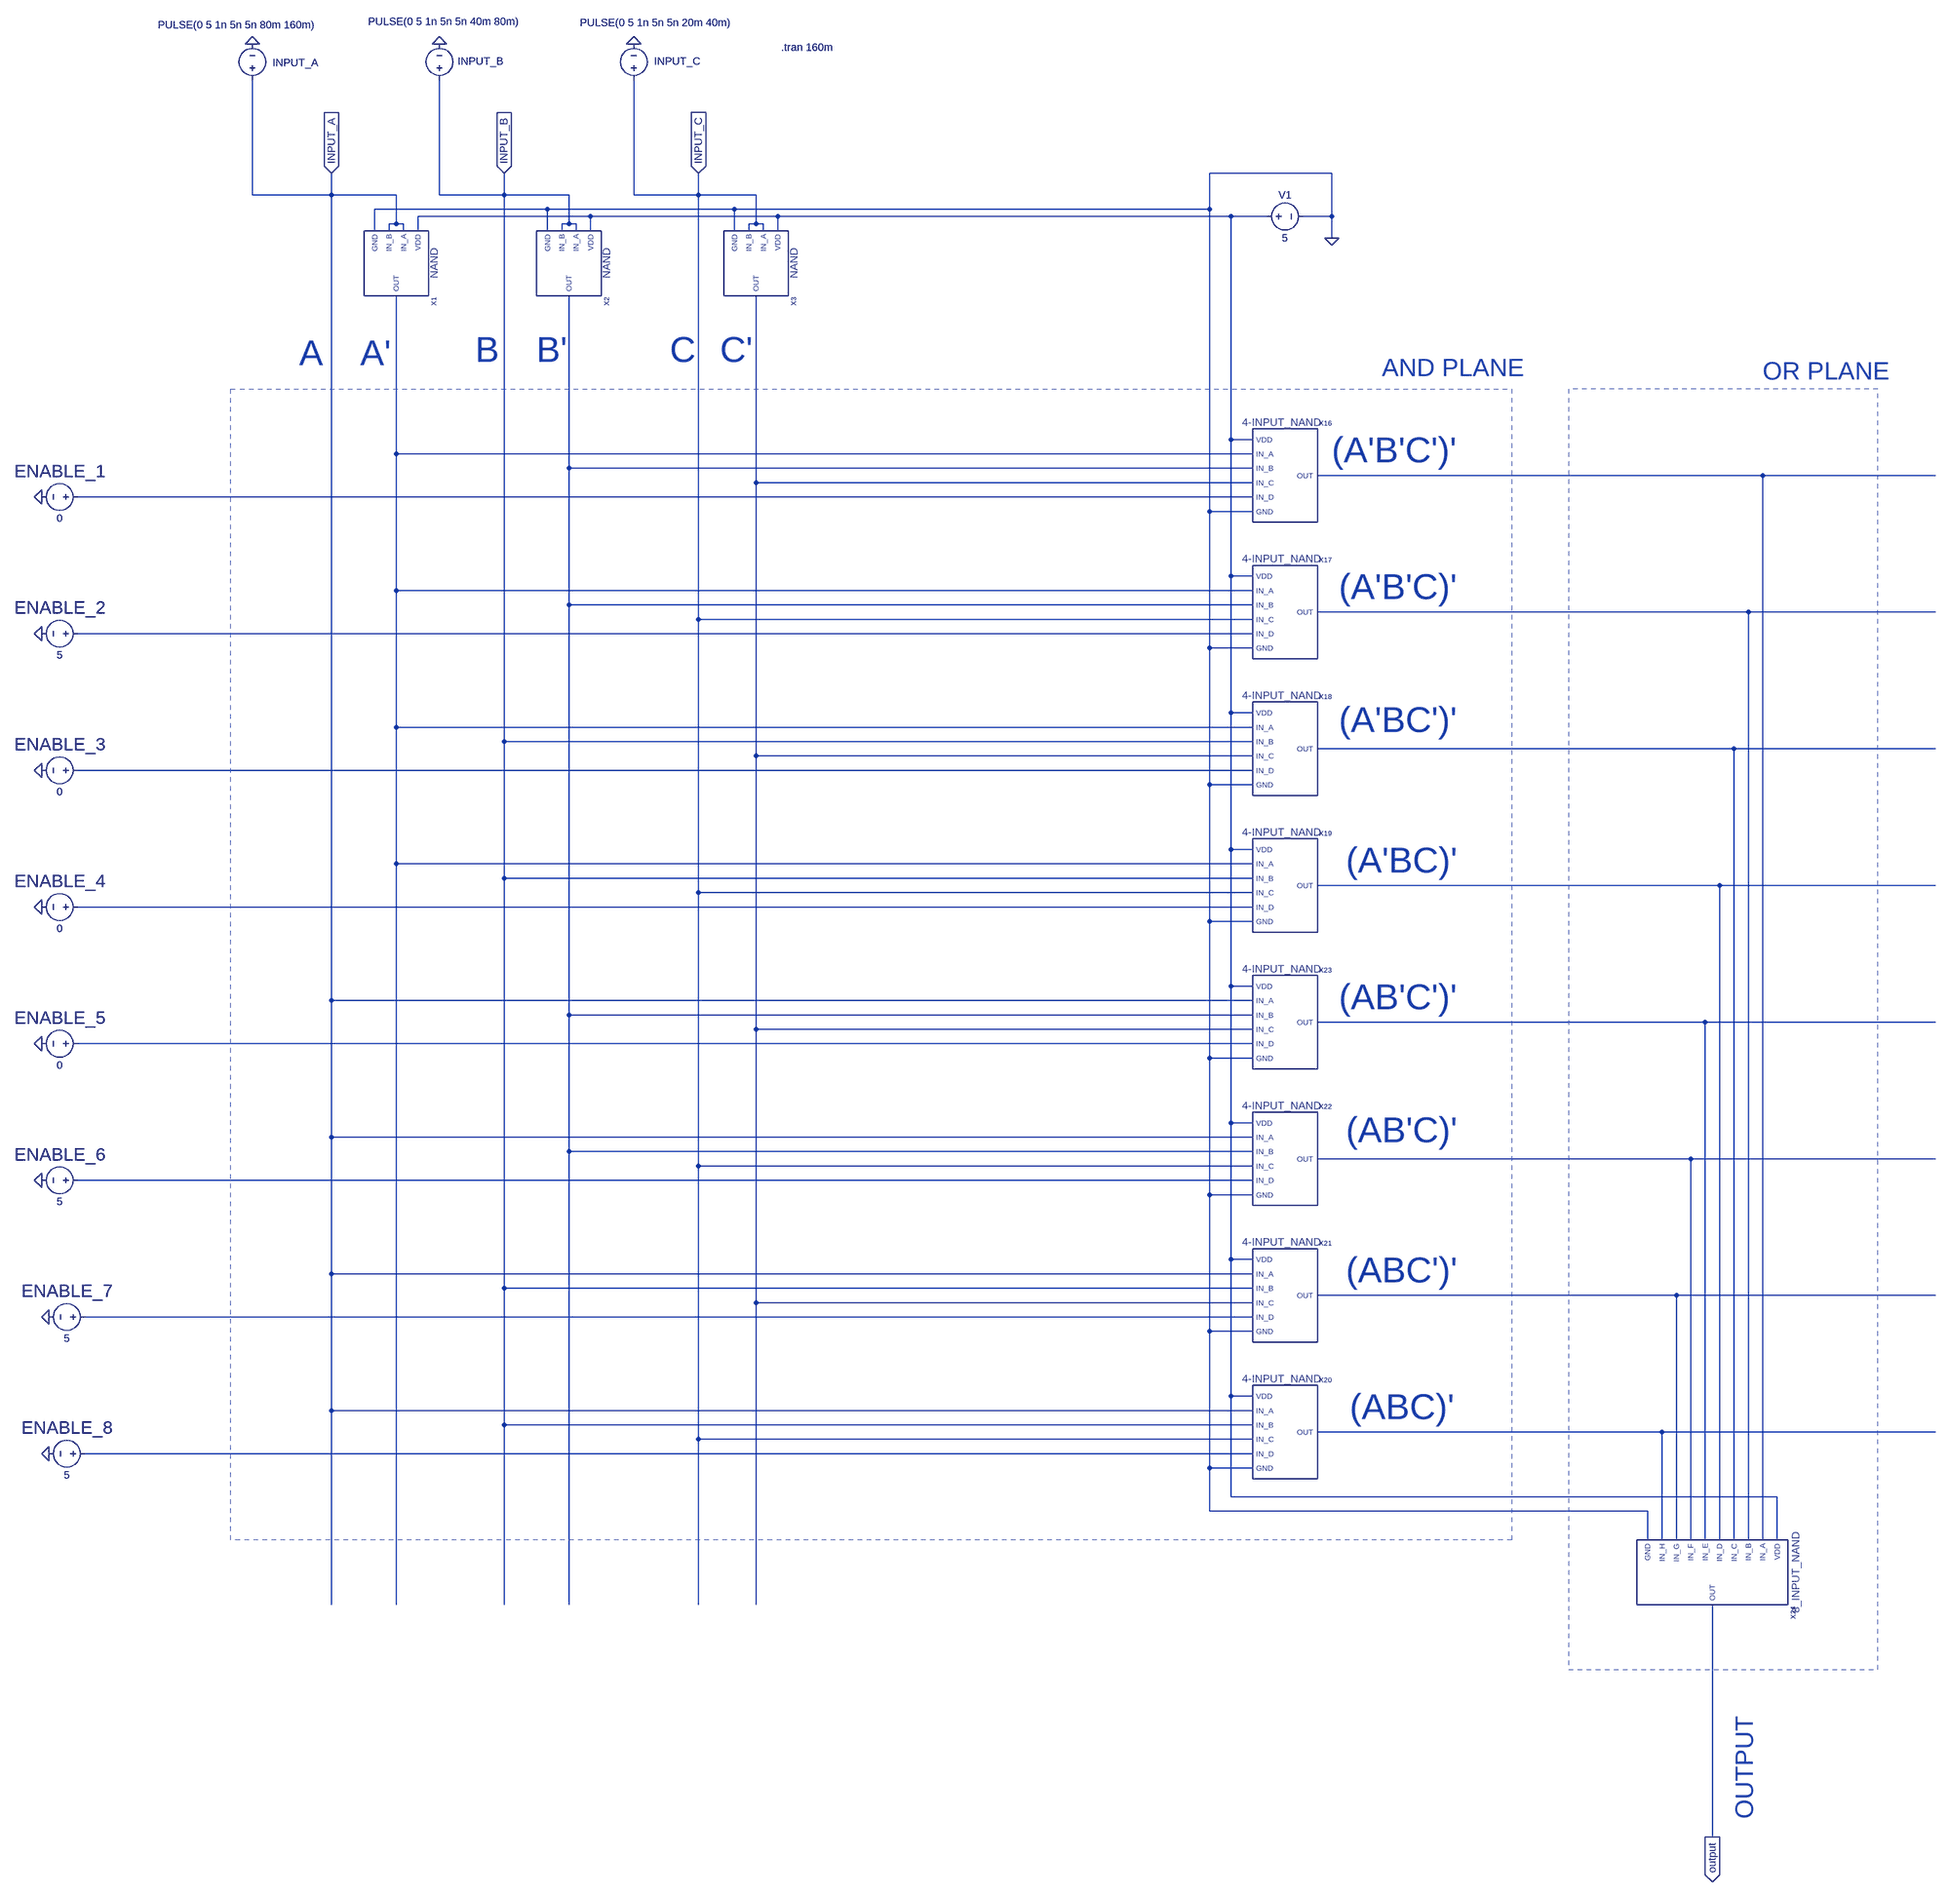
[diagram p0: schematic Circuit2_Part3_3inputCombinational_PLD.asc]
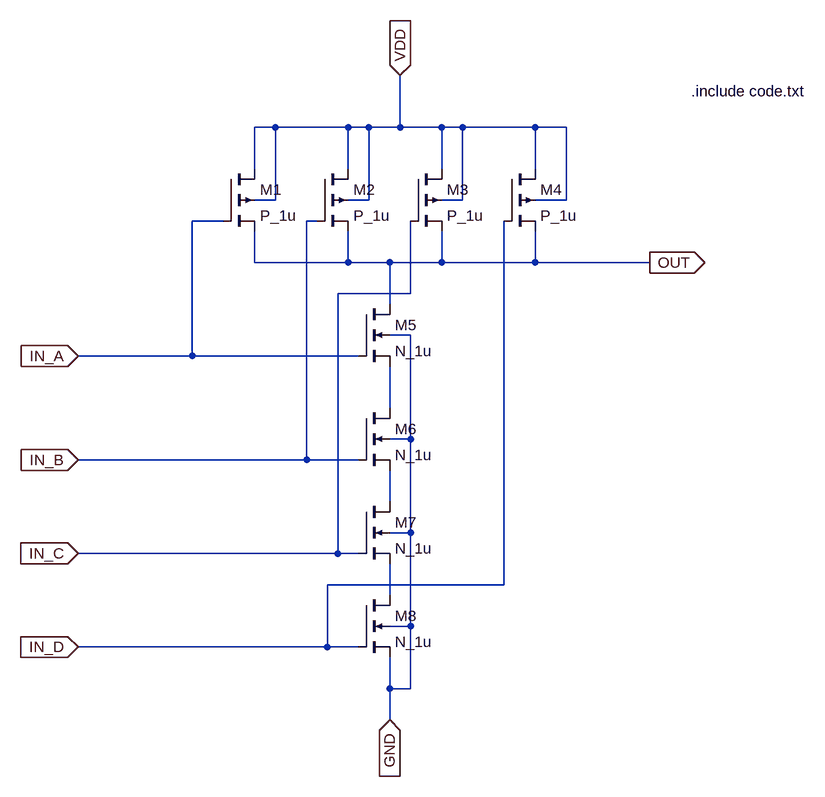
[diagram p1: sub-circuit circuit2_part3_4inputnandusingmosfets.asc]
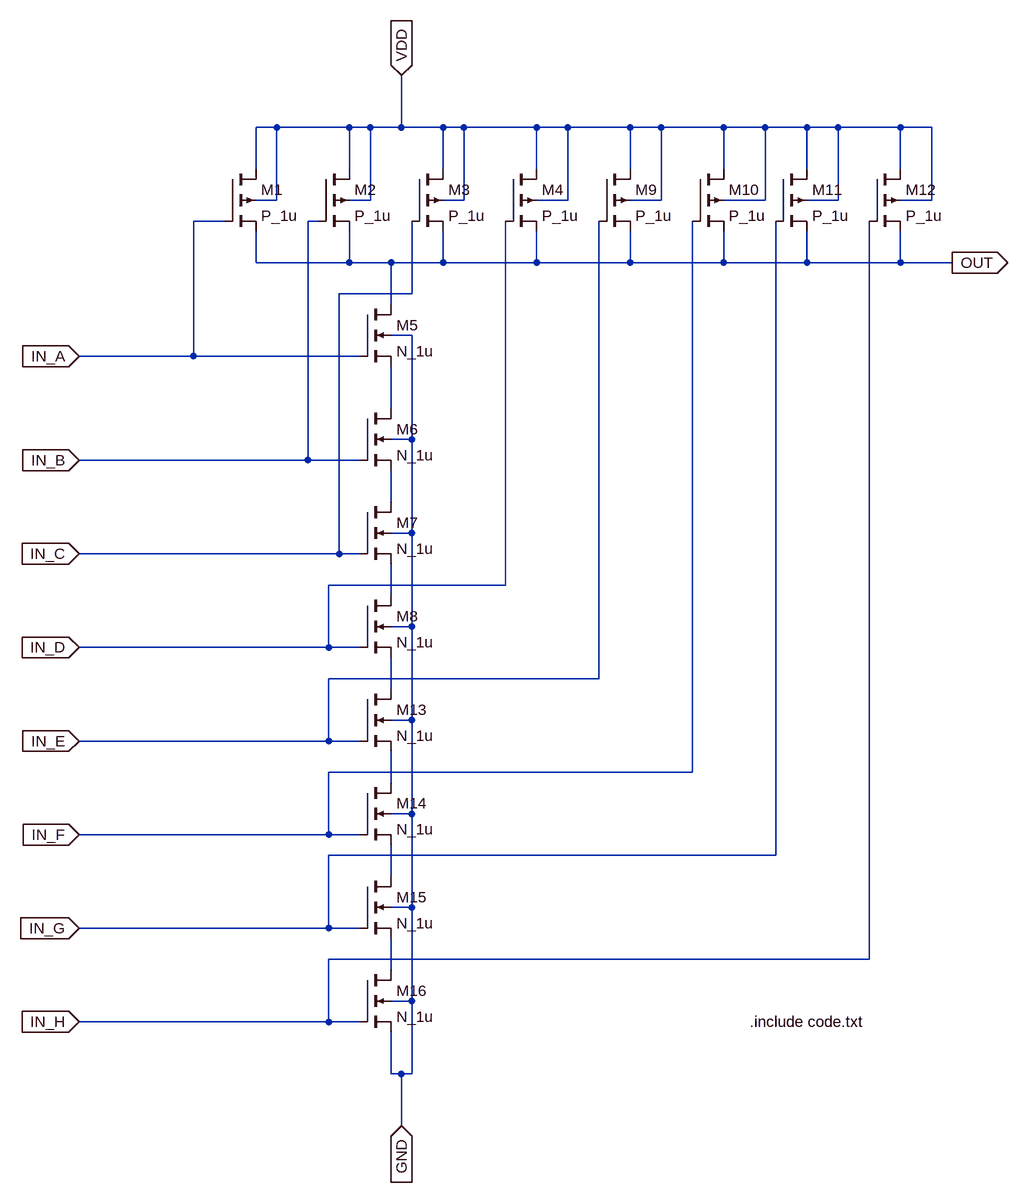
[diagram p2: sub-circuit circuit2_part3_8inputnandusingmosfets.asc]
Circuit2_Part3_3inputCombinational_PLD.asc, the LTspice schematic file:
Version 4
SHEET 1 4452 2924
WIRE 208 -1728 -64 -1728
WIRE -2192 -1680 -2192 -1936
WIRE -2016 -1680 -2016 -1728
WIRE -2016 -1680 -2192 -1680
WIRE -1872 -1680 -2016 -1680
WIRE -1776 -1680 -1776 -1936
WIRE -1632 -1680 -1632 -1728
WIRE -1632 -1680 -1776 -1680
WIRE -1488 -1680 -1632 -1680
WIRE -1344 -1680 -1344 -1936
WIRE -1200 -1680 -1200 -1728
WIRE -1200 -1680 -1344 -1680
WIRE -1072 -1680 -1200 -1680
WIRE -1536 -1648 -1920 -1648
WIRE -1120 -1648 -1536 -1648
WIRE -64 -1648 -64 -1728
WIRE -64 -1648 -1120 -1648
WIRE -1440 -1632 -1824 -1632
WIRE -1024 -1632 -1440 -1632
WIRE -16 -1632 -1024 -1632
WIRE 64 -1632 -16 -1632
WIRE 208 -1632 208 -1728
WIRE 208 -1632 144 -1632
WIRE -1872 -1616 -1872 -1680
WIRE -1872 -1616 -1888 -1616
WIRE -1856 -1616 -1872 -1616
WIRE -1488 -1616 -1488 -1680
WIRE -1488 -1616 -1504 -1616
WIRE -1472 -1616 -1488 -1616
WIRE -1072 -1616 -1072 -1680
WIRE -1072 -1616 -1088 -1616
WIRE -1056 -1616 -1072 -1616
WIRE -1920 -1600 -1920 -1648
WIRE -1888 -1600 -1888 -1616
WIRE -1856 -1600 -1856 -1616
WIRE -1824 -1600 -1824 -1632
WIRE -1536 -1600 -1536 -1648
WIRE -1504 -1600 -1504 -1616
WIRE -1472 -1600 -1472 -1616
WIRE -1440 -1600 -1440 -1632
WIRE -1120 -1600 -1120 -1648
WIRE -1088 -1600 -1088 -1616
WIRE -1056 -1600 -1056 -1616
WIRE -1024 -1600 -1024 -1632
WIRE 208 -1584 208 -1632
WIRE -16 -1136 -16 -1632
WIRE 32 -1136 -16 -1136
WIRE -1872 -1104 -1872 -1456
WIRE 32 -1104 -1872 -1104
WIRE -1488 -1072 -1488 -1456
WIRE 32 -1072 -1488 -1072
WIRE 1968 -1056 176 -1056
WIRE 2384 -1056 1968 -1056
WIRE -1072 -1040 -1072 -1456
WIRE 32 -1040 -1072 -1040
WIRE 32 -1008 -2944 -1008
WIRE -64 -976 -64 -1648
WIRE 32 -976 -64 -976
WIRE -16 -832 -16 -1136
WIRE 32 -832 -16 -832
WIRE -1872 -800 -1872 -1104
WIRE 32 -800 -1872 -800
WIRE -1488 -768 -1488 -1072
WIRE 32 -768 -1488 -768
WIRE 1936 -752 176 -752
WIRE 2384 -752 1936 -752
WIRE -1200 -736 -1200 -1680
WIRE 32 -736 -1200 -736
WIRE 32 -704 -2944 -704
WIRE -64 -672 -64 -976
WIRE 32 -672 -64 -672
WIRE -16 -528 -16 -832
WIRE 32 -528 -16 -528
WIRE -1872 -496 -1872 -800
WIRE 32 -496 -1872 -496
WIRE -1632 -464 -1632 -1680
WIRE 32 -464 -1632 -464
WIRE 1904 -448 176 -448
WIRE 2384 -448 1904 -448
WIRE -1072 -432 -1072 -1040
WIRE 32 -432 -1072 -432
WIRE 32 -400 -2944 -400
WIRE -64 -368 -64 -672
WIRE 32 -368 -64 -368
WIRE -16 -224 -16 -528
WIRE 32 -224 -16 -224
WIRE -1872 -192 -1872 -496
WIRE 32 -192 -1872 -192
WIRE -1632 -160 -1632 -464
WIRE 32 -160 -1632 -160
WIRE 1872 -144 176 -144
WIRE 2384 -144 1872 -144
WIRE -1200 -128 -1200 -736
WIRE 32 -128 -1200 -128
WIRE 32 -96 -2944 -96
WIRE -64 -64 -64 -368
WIRE 32 -64 -64 -64
WIRE -16 80 -16 -224
WIRE 32 80 -16 80
WIRE -2016 112 -2016 -1680
WIRE 32 112 -2016 112
WIRE -1488 144 -1488 -768
WIRE 32 144 -1488 144
WIRE 1840 160 176 160
WIRE 2384 160 1840 160
WIRE -1072 176 -1072 -432
WIRE 32 176 -1072 176
WIRE 32 208 -2944 208
WIRE -64 240 -64 -64
WIRE 32 240 -64 240
WIRE -16 384 -16 80
WIRE 32 384 -16 384
WIRE -2016 416 -2016 112
WIRE 32 416 -2016 416
WIRE -1488 448 -1488 144
WIRE 32 448 -1488 448
WIRE 1808 464 176 464
WIRE 2384 464 1808 464
WIRE -1200 480 -1200 -128
WIRE 32 480 -1200 480
WIRE 32 512 -2944 512
WIRE -64 544 -64 240
WIRE 32 544 -64 544
WIRE -16 688 -16 384
WIRE 32 688 -16 688
WIRE -2016 720 -2016 416
WIRE 32 720 -2016 720
WIRE -1632 752 -1632 -160
WIRE 32 752 -1632 752
WIRE 1776 768 176 768
WIRE 2384 768 1776 768
WIRE -1072 784 -1072 176
WIRE 32 784 -1072 784
WIRE 32 816 -2928 816
WIRE -64 848 -64 544
WIRE 32 848 -64 848
WIRE -16 992 -16 688
WIRE 32 992 -16 992
WIRE -2016 1024 -2016 720
WIRE 32 1024 -2016 1024
WIRE -1632 1056 -1632 752
WIRE 32 1056 -1632 1056
WIRE 1744 1072 176 1072
WIRE 2384 1072 1744 1072
WIRE -1200 1088 -1200 480
WIRE 32 1088 -1200 1088
WIRE 32 1120 -2928 1120
WIRE -64 1152 -64 848
WIRE 32 1152 -64 1152
WIRE -16 1216 -16 992
WIRE 2000 1216 -16 1216
WIRE -64 1248 -64 1152
WIRE 1712 1248 -64 1248
WIRE 1712 1312 1712 1248
WIRE 1744 1312 1744 1072
WIRE 1776 1312 1776 768
WIRE 1808 1312 1808 464
WIRE 1840 1312 1840 160
WIRE 1872 1312 1872 -144
WIRE 1904 1312 1904 -448
WIRE 1936 1312 1936 -752
WIRE 1968 1312 1968 -1056
WIRE 2000 1312 2000 1216
WIRE -2016 1456 -2016 1024
WIRE -1872 1456 -1872 -192
WIRE -1632 1456 -1632 1056
WIRE -1488 1456 -1488 448
WIRE -1200 1456 -1200 1088
WIRE -1072 1456 -1072 784
WIRE 1856 2016 1856 1456
FLAG -2192 -2016 0
FLAG -1776 -2016 0
FLAG -1344 -2016 0
FLAG -2016 -1728 INPUT_A
IOPIN -2016 -1728 In
FLAG -1632 -1728 INPUT_B
IOPIN -1632 -1728 In
FLAG -1200 -1728 INPUT_C
IOPIN -1200 -1728 In
FLAG 1856 2016 output
IOPIN 1856 2016 Out
FLAG -3024 -1008 0
FLAG -3024 -704 0
FLAG -3024 -400 0
FLAG -3024 -96 0
FLAG -3024 208 0
FLAG -3008 1120 0
FLAG -3008 816 0
FLAG -3024 512 0
FLAG 208 -1584 0
SYMBOL voltage -1776 -1920 R180
WINDOW 123 0 0 Left 0
WINDOW 39 0 0 Left 0
WINDOW 0 -142 57 Left 2
WINDOW 3 -179 146 Left 2
SYMATTR InstName INPUT_B
SYMATTR Value PULSE(0 5 1n 5n 5n 40m 80m)
SYMBOL voltage -1344 -1920 R180
WINDOW 123 0 0 Left 0
WINDOW 39 0 0 Left 0
WINDOW 0 -148 57 Left 2
WINDOW 3 -218 143 Left 2
SYMATTR InstName INPUT_C
SYMATTR Value PULSE(0 5 1n 5n 5n 20m 40m)
SYMBOL voltage -2192 -1920 R180
WINDOW 123 0 0 Left 0
WINDOW 39 0 0 Left 0
WINDOW 0 -146 54 Left 2
WINDOW 3 -141 138 Left 2
SYMATTR InstName INPUT_A
SYMATTR Value PULSE(0 5 1n 5n 5n 80m 160m)
SYMBOL voltage -2928 -1008 R90
WINDOW 0 -32 56 VBottom 4
WINDOW 3 32 56 VTop 2
WINDOW 123 0 0 Left 0
WINDOW 39 0 0 Left 0
SYMATTR InstName ENABLE_1
SYMATTR Value 0
SYMBOL voltage -2928 -704 R90
WINDOW 0 -32 56 VBottom 4
WINDOW 3 32 56 VTop 2
WINDOW 123 0 0 Left 0
WINDOW 39 0 0 Left 0
SYMATTR InstName ENABLE_2
SYMATTR Value 5
SYMBOL voltage -2928 -400 R90
WINDOW 0 -32 56 VBottom 4
WINDOW 3 32 56 VTop 2
WINDOW 123 0 0 Left 0
WINDOW 39 0 0 Left 0
SYMATTR InstName ENABLE_3
SYMATTR Value 0
SYMBOL voltage -2928 -96 R90
WINDOW 0 -32 56 VBottom 4
WINDOW 3 32 56 VTop 2
WINDOW 123 0 0 Left 0
WINDOW 39 0 0 Left 0
SYMATTR InstName ENABLE_4
SYMATTR Value 0
SYMBOL voltage -2928 208 R90
WINDOW 0 -32 56 VBottom 4
WINDOW 3 32 56 VTop 2
WINDOW 123 0 0 Left 0
WINDOW 39 0 0 Left 0
SYMATTR InstName ENABLE_5
SYMATTR Value 0
SYMBOL voltage -2928 512 R90
WINDOW 0 -32 56 VBottom 4
WINDOW 3 32 56 VTop 2
WINDOW 123 0 0 Left 0
WINDOW 39 0 0 Left 0
SYMATTR InstName ENABLE_6
SYMATTR Value 5
SYMBOL voltage -2912 816 R90
WINDOW 0 -32 56 VBottom 4
WINDOW 3 32 56 VTop 2
WINDOW 123 0 0 Left 0
WINDOW 39 0 0 Left 0
SYMATTR InstName ENABLE_7
SYMATTR Value 5
SYMBOL voltage -2912 1120 R90
WINDOW 0 -32 56 VBottom 4
WINDOW 3 32 56 VTop 2
WINDOW 123 0 0 Left 0
WINDOW 39 0 0 Left 0
SYMATTR InstName ENABLE_8
SYMATTR Value 5
SYMBOL voltage 48 -1632 R270
WINDOW 0 32 56 VTop 2
WINDOW 3 -32 56 VBottom 2
WINDOW 123 0 0 Left 0
WINDOW 39 0 0 Left 0
SYMATTR InstName V1
SYMATTR Value 5
SYMBOL Circuit2_Part3_4inputNANDUsingMosfets 96 -1056 R0
SYMATTR InstName X16
SYMBOL Circuit2_Part3_4inputNANDUsingMosfets 96 -752 R0
SYMATTR InstName X17
SYMBOL Circuit2_Part3_4inputNANDUsingMosfets 96 -448 R0
SYMATTR InstName X18
SYMBOL Circuit2_Part3_4inputNANDUsingMosfets 96 -144 R0
SYMATTR InstName X19
SYMBOL Circuit2_Part3_4inputNANDUsingMosfets 96 1072 R0
SYMATTR InstName X20
SYMBOL Circuit2_Part3_4inputNANDUsingMosfets 96 768 R0
SYMATTR InstName X21
SYMBOL Circuit2_Part3_4inputNANDUsingMosfets 96 464 R0
SYMATTR InstName X22
SYMBOL Circuit2_Part3_4inputNANDUsingMosfets 96 160 R0
SYMATTR InstName X23
SYMBOL Circuit2_Part3_8inputNANDUsingMosfets 1856 1376 R90
SYMATTR InstName X24
SYMBOL Circuit2_Part3_NANDUsingMosfets -1872 -1536 R90
SYMATTR InstName X1
SYMBOL Circuit2_Part3_NANDUsingMosfets -1488 -1536 R90
SYMATTR InstName X2
SYMBOL Circuit2_Part3_NANDUsingMosfets -1072 -1536 R90
SYMATTR InstName X3
TEXT -1016 -2008 Left 2 !.tran 160m
TEXT -2088 -1328 Left 6 ;A
TEXT -1952 -1328 Left 6 ;A'
TEXT -1696 -1336 Left 6 ;B
TEXT -1560 -1336 Left 6 ;B'
TEXT -1264 -1336 Left 6 ;C
TEXT -1152 -1336 Left 6 ;C'
TEXT 208 -1112 Left 6 ;(A'B'C')'
TEXT 224 -808 Left 6 ;(A'B'C)'
TEXT 224 -512 Left 6 ;(A'BC')'
TEXT 240 -200 Left 6 ;(A'BC)'
TEXT 224 104 Left 6 ;(AB'C')'
TEXT 240 400 Left 6 ;(AB'C)'
TEXT 240 712 Left 6 ;(ABC')'
TEXT 248 1016 Left 6 ;(ABC)'
TEXT 320 -1296 Left 5 ;AND PLANE
TEXT 1968 -1288 Left 5 ;OR PLANE
TEXT 1928 1976 VLeft 5 ;OUTPUT
RECTANGLE Normal -2240 -1248 608 1312 2
RECTANGLE Normal 2224 -1248 1536 1600 2

circuit2_part3_4inputnandusingmosfets.asc, the sub-circuit schematic file:
Version 4
SHEET 1 932 1008
WIRE 96 -16 64 -16
WIRE 208 -16 96 -16
WIRE 240 -16 208 -16
WIRE 288 -16 288 -96
WIRE 288 -16 240 -16
WIRE 352 -16 288 -16
WIRE 384 -16 352 -16
WIRE 496 -16 384 -16
WIRE 544 -16 496 -16
WIRE 64 48 64 -16
WIRE 208 48 208 -16
WIRE 352 48 352 -16
WIRE 496 48 496 -16
WIRE 96 96 96 -16
WIRE 96 96 64 96
WIRE 240 96 240 -16
WIRE 240 96 208 96
WIRE 384 96 384 -16
WIRE 384 96 352 96
WIRE 544 96 544 -16
WIRE 544 96 496 96
WIRE 16 128 -32 128
WIRE 160 128 144 128
WIRE 64 192 64 144
WIRE 208 192 208 144
WIRE 208 192 64 192
WIRE 272 192 208 192
WIRE 352 192 352 144
WIRE 352 192 272 192
WIRE 496 192 496 144
WIRE 496 192 352 192
WIRE 672 192 496 192
WIRE 304 240 304 128
WIRE 304 240 192 240
WIRE 272 256 272 192
WIRE 304 304 272 304
WIRE -32 336 -32 128
WIRE -32 336 -208 336
WIRE 224 336 -32 336
WIRE 272 416 272 352
WIRE 304 464 304 304
WIRE 304 464 272 464
WIRE 144 496 144 128
WIRE 144 496 -208 496
WIRE 224 496 144 496
WIRE 272 560 272 512
WIRE 304 608 304 464
WIRE 304 608 272 608
WIRE 192 640 192 240
WIRE 192 640 -208 640
WIRE 224 640 192 640
WIRE 448 688 448 128
WIRE 448 688 176 688
WIRE 272 704 272 656
WIRE 304 752 304 608
WIRE 304 752 272 752
WIRE 176 784 176 688
WIRE 176 784 -208 784
WIRE 224 784 176 784
WIRE 272 848 272 800
WIRE 304 848 304 752
WIRE 304 848 272 848
WIRE 272 896 272 848
FLAG -208 336 IN_A
IOPIN -208 336 In
FLAG -208 496 IN_B
IOPIN -208 496 In
FLAG -208 640 IN_C
IOPIN -208 640 In
FLAG -208 784 IN_D
IOPIN -208 784 In
FLAG 288 -96 VDD
IOPIN 288 -96 In
FLAG 672 192 OUT
IOPIN 672 192 Out
FLAG 272 896 GND
IOPIN 272 896 In
SYMBOL pmos4 16 48 R0
SYMATTR InstName M1
SYMATTR Value P_1u
SYMATTR Value2 l=1u w=10u
SYMBOL pmos4 160 48 R0
SYMATTR InstName M2
SYMATTR Value P_1u
SYMATTR Value2 l=1u w=10u
SYMBOL pmos4 304 48 R0
SYMATTR InstName M3
SYMATTR Value P_1u
SYMATTR Value2 l=1u w=10u
SYMBOL pmos4 448 48 R0
SYMATTR InstName M4
SYMATTR Value P_1u
SYMATTR Value2 l=1u w=10u
SYMBOL nmos4 224 256 R0
SYMATTR InstName M5
SYMATTR Value N_1u
SYMATTR Value2 l=1u w=10u
SYMBOL nmos4 224 416 R0
SYMATTR InstName M6
SYMATTR Value N_1u
SYMATTR Value2 l=1u w=10u
SYMBOL nmos4 224 560 R0
SYMATTR InstName M7
SYMATTR Value N_1u
SYMATTR Value2 l=1u w=10u
SYMBOL nmos4 224 704 R0
SYMATTR InstName M8
SYMATTR Value N_1u
SYMATTR Value2 l=1u w=10u
TEXT 736 -72 Left 2 !.include code.txt

circuit2_part3_8inputnandusingmosfets.asc, the sub-circuit schematic file:
Version 4
SHEET 1 1244 1632
WIRE 96 -16 64 -16
WIRE 208 -16 96 -16
WIRE 240 -16 208 -16
WIRE 288 -16 288 -96
WIRE 288 -16 240 -16
WIRE 352 -16 288 -16
WIRE 384 -16 352 -16
WIRE 496 -16 384 -16
WIRE 544 -16 496 -16
WIRE 640 -16 544 -16
WIRE 688 -16 640 -16
WIRE 784 -16 688 -16
WIRE 848 -16 784 -16
WIRE 912 -16 848 -16
WIRE 960 -16 912 -16
WIRE 1056 -16 960 -16
WIRE 1104 -16 1056 -16
WIRE 64 48 64 -16
WIRE 208 48 208 -16
WIRE 352 48 352 -16
WIRE 496 48 496 -16
WIRE 640 48 640 -16
WIRE 784 48 784 -16
WIRE 912 48 912 -16
WIRE 1056 48 1056 -16
WIRE 96 96 96 -16
WIRE 96 96 64 96
WIRE 240 96 240 -16
WIRE 240 96 208 96
WIRE 384 96 384 -16
WIRE 384 96 352 96
WIRE 544 96 544 -16
WIRE 544 96 496 96
WIRE 688 96 688 -16
WIRE 688 96 640 96
WIRE 848 96 848 -16
WIRE 848 96 784 96
WIRE 960 96 960 -16
WIRE 960 96 912 96
WIRE 1104 96 1104 -16
WIRE 1104 96 1056 96
WIRE 16 128 -32 128
WIRE 160 128 144 128
WIRE 64 192 64 144
WIRE 208 192 208 144
WIRE 208 192 64 192
WIRE 272 192 208 192
WIRE 352 192 352 144
WIRE 352 192 272 192
WIRE 496 192 496 144
WIRE 496 192 352 192
WIRE 640 192 640 144
WIRE 640 192 496 192
WIRE 784 192 784 144
WIRE 784 192 640 192
WIRE 912 192 912 144
WIRE 912 192 784 192
WIRE 1056 192 1056 144
WIRE 1056 192 912 192
WIRE 1136 192 1056 192
WIRE 304 240 304 128
WIRE 304 240 192 240
WIRE 272 256 272 192
WIRE 304 304 272 304
WIRE -32 336 -32 128
WIRE -32 336 -208 336
WIRE 224 336 -32 336
WIRE 272 416 272 352
WIRE 304 464 304 304
WIRE 304 464 272 464
WIRE 144 496 144 128
WIRE 144 496 -208 496
WIRE 224 496 144 496
WIRE 272 560 272 512
WIRE 304 608 304 464
WIRE 304 608 272 608
WIRE 192 640 192 240
WIRE 192 640 -208 640
WIRE 224 640 192 640
WIRE 448 688 448 128
WIRE 448 688 176 688
WIRE 272 704 272 656
WIRE 304 752 304 608
WIRE 304 752 272 752
WIRE 176 784 176 688
WIRE 176 784 -208 784
WIRE 224 784 176 784
WIRE 592 832 592 128
WIRE 592 832 176 832
WIRE 272 848 272 800
WIRE 304 896 304 752
WIRE 304 896 272 896
WIRE 176 928 176 832
WIRE 176 928 -208 928
WIRE 224 928 176 928
WIRE 736 976 736 128
WIRE 736 976 176 976
WIRE 272 992 272 944
WIRE 304 1040 304 896
WIRE 304 1040 272 1040
WIRE 176 1072 176 976
WIRE 176 1072 -208 1072
WIRE 224 1072 176 1072
WIRE 864 1104 864 128
WIRE 864 1104 176 1104
WIRE 272 1136 272 1088
WIRE 304 1184 304 1040
WIRE 304 1184 272 1184
WIRE 176 1216 176 1104
WIRE 176 1216 -208 1216
WIRE 224 1216 176 1216
WIRE 1008 1264 1008 128
WIRE 1008 1264 176 1264
WIRE 272 1280 272 1232
WIRE 304 1328 304 1184
WIRE 304 1328 272 1328
WIRE 176 1360 176 1264
WIRE 176 1360 -208 1360
WIRE 224 1360 176 1360
WIRE 272 1440 272 1376
WIRE 288 1440 272 1440
WIRE 304 1440 304 1328
WIRE 304 1440 288 1440
WIRE 288 1520 288 1440
FLAG -208 336 IN_A
IOPIN -208 336 In
FLAG -208 496 IN_B
IOPIN -208 496 In
FLAG -208 640 IN_C
IOPIN -208 640 In
FLAG -208 784 IN_D
IOPIN -208 784 In
FLAG 288 -96 VDD
IOPIN 288 -96 In
FLAG 1136 192 OUT
IOPIN 1136 192 Out
FLAG 288 1520 GND
IOPIN 288 1520 In
FLAG -208 928 IN_E
IOPIN -208 928 In
FLAG -208 1072 IN_F
IOPIN -208 1072 In
FLAG -208 1216 IN_G
IOPIN -208 1216 In
FLAG -208 1360 IN_H
IOPIN -208 1360 In
SYMBOL pmos4 16 48 R0
SYMATTR InstName M1
SYMATTR Value P_1u
SYMATTR Value2 l=1u w=10u
SYMBOL pmos4 160 48 R0
SYMATTR InstName M2
SYMATTR Value P_1u
SYMATTR Value2 l=1u w=10u
SYMBOL pmos4 304 48 R0
SYMATTR InstName M3
SYMATTR Value P_1u
SYMATTR Value2 l=1u w=10u
SYMBOL pmos4 448 48 R0
SYMATTR InstName M4
SYMATTR Value P_1u
SYMATTR Value2 l=1u w=10u
SYMBOL nmos4 224 256 R0
SYMATTR InstName M5
SYMATTR Value N_1u
SYMATTR Value2 l=1u w=10u
SYMBOL nmos4 224 416 R0
SYMATTR InstName M6
SYMATTR Value N_1u
SYMATTR Value2 l=1u w=10u
SYMBOL nmos4 224 560 R0
SYMATTR InstName M7
SYMATTR Value N_1u
SYMATTR Value2 l=1u w=10u
SYMBOL nmos4 224 704 R0
SYMATTR InstName M8
SYMATTR Value N_1u
SYMATTR Value2 l=1u w=10u
SYMBOL pmos4 592 48 R0
SYMATTR InstName M9
SYMATTR Value P_1u
SYMATTR Value2 l=1u w=10u
SYMBOL pmos4 736 48 R0
SYMATTR InstName M10
SYMATTR Value P_1u
SYMATTR Value2 l=1u w=10u
SYMBOL pmos4 864 48 R0
SYMATTR InstName M11
SYMATTR Value P_1u
SYMATTR Value2 l=1u w=10u
SYMBOL pmos4 1008 48 R0
SYMATTR InstName M12
SYMATTR Value P_1u
SYMATTR Value2 l=1u w=10u
SYMBOL nmos4 224 848 R0
SYMATTR InstName M13
SYMATTR Value N_1u
SYMATTR Value2 l=1u w=10u
SYMBOL nmos4 224 992 R0
SYMATTR InstName M14
SYMATTR Value N_1u
SYMATTR Value2 l=1u w=10u
SYMBOL nmos4 224 1136 R0
SYMATTR InstName M15
SYMATTR Value N_1u
SYMATTR Value2 l=1u w=10u
SYMBOL nmos4 224 1280 R0
SYMATTR InstName M16
SYMATTR Value N_1u
SYMATTR Value2 l=1u w=10u
TEXT 824 1360 Left 2 !.include code.txt

The netlist it stands for:
* Circuit2_Part3_3inputCombinational_PLD.asc
V§INPUT_B INPUT_B 0 PULSE(0 5 1n 5n 5n 40m 80m)
V§INPUT_C INPUT_C 0 PULSE(0 5 1n 5n 5n 20m 40m)
V§INPUT_A INPUT_A 0 PULSE(0 5 1n 5n 5n 80m 160m)
V§ENABLE_1 N006 0 0
V§ENABLE_2 N008 0 5
V§ENABLE_3 N010 0 0
V§ENABLE_4 N012 0 0
V§ENABLE_5 N014 0 0
V§ENABLE_6 N016 0 5
V§ENABLE_7 N018 0 5
V§ENABLE_8 N020 0 5
V1 N001 0 5
XX16 0 N002 N003 N005 N006 N001 N004 circuit2_part3_4inputnandusingmosfets
XX17 0 N002 N003 INPUT_C N008 N001 N007 circuit2_part3_4inputnandusingmosfets
XX18 0 N002 INPUT_B N005 N010 N001 N009 circuit2_part3_4inputnandusingmosfets
XX19 0 N002 INPUT_B INPUT_C N012 N001 N011 circuit2_part3_4inputnandusingmosfets
XX20 0 INPUT_A INPUT_B INPUT_C N020 N001 N019 circuit2_part3_4inputnandusingmosfets
XX21 0 INPUT_A INPUT_B N005 N018 N001 N017 circuit2_part3_4inputnandusingmosfets
XX22 0 INPUT_A N003 INPUT_C N016 N001 N015 circuit2_part3_4inputnandusingmosfets
XX23 0 INPUT_A N003 N005 N014 N001 N013 circuit2_part3_4inputnandusingmosfets
XX24 0 N004 N007 N009 N011 N013 N015 N017 N019 N001 output circuit2_part3_8inputnandusingmosfets
XX1 0 INPUT_A INPUT_A N001 N002 Circuit2_Part3_NANDUsingMosfets  ; pins GND IN_A IN_B VDD OUT
XX2 0 INPUT_B INPUT_B N001 N003 Circuit2_Part3_NANDUsingMosfets  ; pins GND IN_A IN_B VDD OUT
XX3 0 INPUT_C INPUT_C N001 N005 Circuit2_Part3_NANDUsingMosfets  ; pins GND IN_A IN_B VDD OUT

* block symbol definitions
.subckt circuit2_part3_4inputnandusingmosfets GND IN_A IN_B IN_C IN_D VDD OUT
M1 VDD IN_A OUT VDD P_1u l=1u w=10u
M2 VDD IN_B OUT VDD P_1u l=1u w=10u
M3 VDD IN_C OUT VDD P_1u l=1u w=10u
M4 VDD IN_D OUT VDD P_1u l=1u w=10u
M5 OUT IN_A N001 GND N_1u l=1u w=10u
M6 N001 IN_B N002 GND N_1u l=1u w=10u
M7 N002 IN_C N003 GND N_1u l=1u w=10u
M8 N003 IN_D GND GND N_1u l=1u w=10u
.include code.txt
.ends circuit2_part3_4inputnandusingmosfets

.subckt circuit2_part3_8inputnandusingmosfets GND IN_A IN_B IN_C IN_D IN_E IN_F IN_G IN_H VDD OUT
M1 VDD IN_A OUT VDD P_1u l=1u w=10u
M2 VDD IN_B OUT VDD P_1u l=1u w=10u
M3 VDD IN_C OUT VDD P_1u l=1u w=10u
M4 VDD IN_D OUT VDD P_1u l=1u w=10u
M5 OUT IN_A N001 GND N_1u l=1u w=10u
M6 N001 IN_B N002 GND N_1u l=1u w=10u
M7 N002 IN_C N003 GND N_1u l=1u w=10u
M8 N003 IN_D N004 GND N_1u l=1u w=10u
M9 VDD IN_E OUT VDD P_1u l=1u w=10u
M10 VDD IN_F OUT VDD P_1u l=1u w=10u
M11 VDD IN_G OUT VDD P_1u l=1u w=10u
M12 VDD IN_H OUT VDD P_1u l=1u w=10u
M13 N004 IN_E N005 GND N_1u l=1u w=10u
M14 N005 IN_F N006 GND N_1u l=1u w=10u
M15 N006 IN_G N007 GND N_1u l=1u w=10u
M16 N007 IN_H GND GND N_1u l=1u w=10u
.include code.txt
.ends circuit2_part3_8inputnandusingmosfets

.model NMOS NMOS
.model PMOS PMOS
.lib standard.mos
.tran 160m
* A
* A'
* B
* B'
* C
* C'
* (A'B'C')'
* (A'B'C)'
* (A'BC')'
* (A'BC)'
* (AB'C')'
* (AB'C)'
* (ABC')'
* (ABC)'
* AND PLANE
* OR PLANE
* OUTPUT
.backanno
.end